# Altium project Strobe.PrjPcb
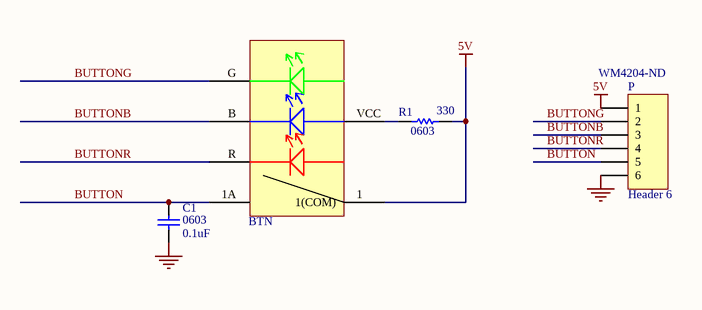
[diagram p0: Strobe.SchDoc]
1 sheet, 4 parts. Net scope: global (net labels, ports and power ports of the same name join across sheets).
Board file: Strobe.PcbDoc

## Sheet Strobe.SchDoc
size A

### Parts
BTN  KP0115ANBKG03RGB-2SJB  [KP0115ANBKG03RGB-2SJB]  (value not drawn)
C1  0603  value 0.1uF  [C0603]
P  Header 6  Supplier Part Number 1: WM4204-ND  [Molex HDR1X6]
R1  0603  value 330  [R0603]

### Nets
5V: BTN.1(1(COM)) P.1 R1.2
GND: C1.1 P.6
BUTTON: BTN.1A C1.2 P.5
BUTTONB: BTN.B(B(-)) P.3
BUTTONG: BTN.G(G(-)) P.2
BUTTONR: BTN.R(R(-)) P.4
NetBTN_VCC: BTN.VCC(3V3) R1.1

### Library data of the parts
BTN = KP0115ANBKG03RGB-2SJB: Pushbutton Switch SPST-NO Standard, Illuminated Through Hole; Manufacturer 1: NKK Switches; Actuator Material: Polyacetal; Mechanical Life: 5000000Cycles; Illumination Color: Blue,Green,Red; Throw Configuration: SPST; Max Current Rating: 100mA; Illumination Type: LED; Voltage Rating (DC): 12V; Actuator Type: Square, Button; Switch Function: Off-Mom; Supplier 1: Digi-Key; Manufacturer Part Number 1: KP0115ANBKG03RGB-2SJB; Stock 1: 22; Pricing 1: 1=20.27000, 10=18.40500, 25=17.57800, 50=16.64740, 100=16.02700, 250=14.99300, 500=12.40800 (USD); RoHS: Yes; Mount: Through Hole; Contact Material: Stainless Steel; Contact Plating: Gold; Housing Material: Glass fibre; Min Operating Temperature: -25°C; Max Operating Temperature: 50°C; Current Rating: 100mA; Package Quantity: 1; Packaging: Bulk; Max Voltage Rating (DC): 12V; Termination: PC Pins; Electrical Life: 5000000Cycles; Length: 17.4mm; Depth: 17.4mm; Lead Free: Lead Free; ComponentLink1URL: https://datasheet.ciiva.com/16864/70192969-16864678.pdf?src-supplier=Allied+Electronics; ComponentLink1Description: https://datasheet.ciiva.com/16864/70192969-16864678.pdf?src-supplier=Allied+Electronics; ComponentLink2URL: https://datasheet.ciiva.com/2870/kp01-2870071.pdf?src-supplier=Digi-Key; ComponentLink2Description: https://datasheet.ciiva.com/2870/kp01-2870071.pdf?src-supplier=Digi-Key; Supplier Part Number 1: 360-2465-ND
C1 = Cap: CAP CER 0.1UF 50V X5R 0603; Manufacturer 1: Yageo; Manufacturer Part Number 1: CC0603KRX5R9BB104; Capacitance: 100nF; Tolerance: 10%; ComponentLink1URL: https://datasheet.ciiva.com/30062/tmk212bbj106kg-t-30062083.pdf?src-supplier=Onlinecomponents.com; ComponentLink1Description: https://datasheet.ciiva.com/30062/tmk212bbj106kg-t-30062083.pdf?src-supplier=Onlinecomponents.com; ComponentLink2URL: https://datasheet.ciiva.com/139/mlcc-all-e-139570.pdf?src-supplier=Digi-Key; ComponentLink2Description: https://datasheet.ciiva.com/139/mlcc-all-e-139570.pdf?src-supplier=Digi-Key; ComponentLink3URL: https://datasheet.ciiva.com/139/mlcc-all-e-139571.pdf?src-supplier=Digi-Key; ComponentLink3Description: https://datasheet.ciiva.com/139/mlcc-all-e-139571.pdf?src-supplier=Digi-Key; ComponentLink4URL: https://datasheet.ciiva.com/139/mlcc-all-e-139572.pdf?src-supplier=Digi-Key; ComponentLink4Description: https://datasheet.ciiva.com/139/mlcc-all-e-139572.pdf?src-supplier=Digi-Key; ComponentLink5URL: https://datasheet.ciiva.com/7975/1481447-7975820.pdf?src-supplier=Element14; ComponentLink5Description: https://datasheet.ciiva.com/7975/1481447-7975820.pdf?src-supplier=Element14; ComponentLink6URL: https://datasheet.ciiva.com/144/mlccorderingcode-144037.pdf?src-supplier=Digi-Key; ComponentLink6Description: https://datasheet.ciiva.com/144/mlccorderingcode-144037.pdf?src-supplier=Digi-Key; ComponentLink7URL: https://datasheet.ciiva.com/8033/1489800-8033669.pdf?src-supplier=Element14; ComponentLink7Description: https://datasheet.ciiva.com/8033/1489800-8033669.pdf?src-supplier=Element14; ComponentLink8URL: https://datasheet.ciiva.com/15189/getdatasheetpartid-321421-15189125.pdf?src-supplier=Verical; ComponentLink8Description: https://datasheet.ciiva.com/15189/getdatasheetpartid-321421-15189125.pdf?src-supplier=Verical; ComponentLink9URL: https://datasheet.ciiva.com/144/mlccorderingcode-144038.pdf?src-supplier=Digi-Key; ComponentLink9Description: https://datasheet.ciiva.com/144/mlccorderingcode-144038.pdf?src-supplier=Digi-Key; ComponentLink10URL: https://datasheet.ciiva.com/28450/1489800-28450342.pdf?src-supplier=Element14; ComponentLink10Description: https://datasheet.ciiva.com/28450/1489800-28450342.pdf?src-supplier=Element14; ComponentLink11URL: https://datasheet.ciiva.com/144/mlccorderingcode-144039.pdf?src-supplier=Digi-Key; ComponentLink11Description: https://datasheet.ciiva.com/144/mlccorderingcode-144039.pdf?src-supplier=Digi-Key; ComponentLink12URL: https://datasheet.ciiva.com/8033/1489800-8033671.pdf?src-supplier=Element14; ComponentLink12Description: https://datasheet.ciiva.com/8033/1489800-8033671.pdf?src-supplier=Element14; ComponentLink13URL: http://www.farnell.com/datasheets/1872206.pdf?src-supplier=Farnell; ComponentLink13Description: http://www.farnell.com/datasheets/1872206.pdf?src-supplier=Farnell; ComponentLink14URL: http://uk.rs-online.com/webdocs/144c/0900766b8144c113.pdf?src-supplier=RSComponents; ComponentLink14Description: http://uk.rs-online.com/webdocs/144c/0900766b8144c113.pdf?src-supplier=RSComponents; ComponentLink15URL: http://www.farnell.com/datasheets/2048008.pdf?src-supplier=Farnell; ComponentLink15Description: http://www.farnell.com/datasheets/2048008.pdf?src-supplier=Farnell; ComponentLink16URL: http://www.mouser.com/ds/2/281/c02e-2905.pdf?src-supplier=Mouser; ComponentLink16Description: http://www.mouser.com/ds/2/281/c02e-2905.pdf?src-supplier=Mouser; ComponentLink17URL: http://components.arrow.com/part/dataview/0323_06361249?src-supplier=Arrow+Europe; ComponentLink17Description: http://components.arrow.com/part/dataview/0323_06361249?src-supplier=Arrow+Europe; ComponentLink18URL: https://search.murata.co.jp/Ceramy/image/img/A01X/G101/ENG/GRM155R71E104KE14-01.pdf?src-supplier=Digi-Key; ComponentLink18Description: https://search.murata.co.jp/Ceramy/image/img/A01X/G101/ENG/GRM155R71E104KE14-01.pdf?src-supplier=Digi-Key; ComponentLink19URL: http://www.farnell.com/datasheets/2048008.pdf?src-supplier=Newark; ComponentLink19Description: http://www.farnell.com/datasheets/2048008.pdf?src-supplier=Newark; ComponentLink20URL: http://psearch.en.murata.com/capacitor/product/GRM155R71E104KE14%23.pdf?src-supplier=Avnet; ComponentLink20Description: http://psearch.en.murata.com/capacitor/product/GRM155R71E104KE14%23.pdf?src-supplier=Avnet; ComponentLink21URL: http://www.farnell.com/datasheets/2048008.pdf?src-supplier=Element14; ComponentLink21Description: http://www.farnell.com/datasheets/2048008.pdf?src-supplier=Element14; Supplier 1: Digi-Key; Supplier Part Number 1: 311-4046-1-ND; Stock 1: 3816; Pricing 1: 1=0.10000, 10=0.05600, 50=0.03080, 100=0.02510, 500=0.01794, 1000=0.01410 (USD); RoHS: Yes; Mount: Surface Mount; Case/Package: 0603; Case Code (Imperial): 0603; Case Code (Metric): 1608; Weight: 7.1E-05oz; Min Operating Temperature: -55°C; Max Operating Temperature: 85°C; Packaging: Tape and Reel; Voltage Rating: 50V; Dielectric: X5R; Termination: SMD/SMT; Voltage Rating (DC): 50V; Package Quantity: 4000; Length: 0.063inch; Width: 0.031inch; Thickness: 0.035inch; Lead Free: Lead Free; Halogen Free: Halogen Free; ComponentLink22URL: http://www.mouser.com/ds/2/447/Yageo_UPY-GP_NP0_16V-to-50V_9-358835.pdf?src-supplier=Mouser; ComponentLink22Description: http://www.mouser.com/ds/2/447/Yageo_UPY-GP_NP0_16V-to-50V_9-358835.pdf?src-supplier=Mouser; ComponentLink23URL: http://www.yageo.com/documents/recent/UPY-GPHC_X5R_4V-to-50V_25.pdf?src-supplier=Digi-Key; ComponentLink23Description: http://www.yageo.com/documents/recent/UPY-GPHC_X5R_4V-to-50V_25.pdf?src-supplier=Digi-Key; ComponentLink24URL: http://www.yageo.com/exep/pages/download/literatures/ProductSelectionGuide%202014_Final_2.pdf?src-supplier=Digi-Key; ComponentLink24Description: http://www.yageo.com/exep/pages/download/literatures/ProductSelectionGuide%202014_Final_2.pdf?src-supplier=Digi-Key
P = Header 6: CONN HEADER VERT 6POS 2.54MM; Manufacturer 1: Molex; Number of Positions: 6; Gender: Male; Contact Resistance: 10mR; Current Rating: 4A; Voltage Rating: 250V; Max Current Rating: 7A; Max Voltage Rating (AC): 600V; Insulation Resistance: 500GR; Approvals: UL,CSA; Glow Wire Compliant: Non-compliant; LatestRevisionDate: 17-Jul-2002; LatestRevisionNote: Re-released for DXP Platform.; Publisher: Altium Limited; Supplier 1: Digi-Key; Manufacturer Part Number 1: 22-23-2061; Stock 1: 22943; Pricing 1: 1=0.43000, 10=0.40300, 100=0.28180, 500=0.24150, 1000=0.20125, 5000=0.17250, 10000=0.16100 (USD); RoHS: Yes; Mount: Through Hole,Cable; Color: White; Housing Color: Orange; Housing Material: Nylon; Contact Material: Brass,Copper Alloy; Contact Plating: Tin,Copper; Min Operating Temperature: 0°C; Max Operating Temperature: 75°C; Number of Rows: 1; Packaging: Bulk; Termination: Through Hole; Number of Contacts: 6; Orientation: Straight; Package Quantity: 1000; Number of Circuits: 6; Voltage Rating (DC): 250V; Length: 31.7mm; Height: 18.42mm; Pitch: 2.54mm; Depth: 9.02mm; Radiation Hardening: No; REACH SVHC: Unknown; Halogen Free: Low Halogen; Lead Free: Lead Free; Flammability Rating: UL94 V-0; ComponentLink1URL: https://datasheet.ciiva.com/5158/0022232061-pcb-headers-227101-5158944.pdf?src-supplier=Mouser; ComponentLink1Description: https://datasheet.ciiva.com/5158/0022232061-pcb-headers-227101-5158944.pdf?src-supplier=Mouser; ComponentLink2URL: https://datasheet.ciiva.com/10086/0022232061-pcb-headers-10086340.pdf?src-supplier=Avnet; ComponentLink2Description: https://datasheet.ciiva.com/10086/0022232061-pcb-headers-10086340.pdf?src-supplier=Avnet; ComponentLink3URL: https://datasheet.ciiva.com/11746/0900766b80d8f4d1-11746779.pdf?src-supplier=RSComponents; ComponentLink3Description: https://datasheet.ciiva.com/11746/0900766b80d8f4d1-11746779.pdf?src-supplier=RSComponents; ComponentLink4URL: https://datasheet.ciiva.com/19462/1966261-19462363.pdf?src-supplier=Jameco; ComponentLink4Description: https://datasheet.ciiva.com/19462/1966261-19462363.pdf?src-supplier=Jameco; ComponentLink5URL: https://datasheet.ciiva.com/19460/232303-19460895.pdf?src-supplier=Jameco; ComponentLink5Description: https://datasheet.ciiva.com/19460/232303-19460895.pdf?src-supplier=Jameco; ComponentLink6URL: https://datasheet.ciiva.com/26844/getdatasheetpartid-256364-26844021.pdf?src-supplier=Verical; ComponentLink6Description: https://datasheet.ciiva.com/26844/getdatasheetpartid-256364-26844021.pdf?src-supplier=Verical; ComponentLink7URL: https://datasheet.ciiva.com/16468/0022232061-pcb-headers-16468934.pdf?src-supplier=Avnet+Asia; ComponentLink7Description: https://datasheet.ciiva.com/16468/0022232061-pcb-headers-16468934.pdf?src-supplier=Avnet+Asia; ComponentLink8URL: https://datasheet.ciiva.com/16658/0022232061-pcb-headers-16658169.pdf?src-supplier=Avnet+Europe; ComponentLink8Description: https://datasheet.ciiva.com/16658/0022232061-pcb-headers-16658169.pdf?src-supplier=Avnet+Europe; ComponentLink9URL: https://datasheet.ciiva.com/30075/16920022232061-pcb-headers-30075692.pdf?src-supplier=Onlinecomponents.com; ComponentLink9Description: https://datasheet.ciiva.com/30075/16920022232061-pcb-headers-30075692.pdf?src-supplier=Onlinecomponents.com
R1 = Res1: RES SMD 330 OHM 1% 1/10W 0603; Manufacturer 1: Yageo; Manufacturer Part Number 1: RC0603FR-07330RL; Max Power Dissipation: 100mW; Temperature Coefficient: 100ppm/°C; Voltage Rating (DC): 50V; Resistance: 330R; ComponentLink1URL: https://datasheet.ciiva.com/11819/0900766b80c66297-11819490.pdf?src-supplier=RSComponents; ComponentLink1Description: https://datasheet.ciiva.com/11819/0900766b80c66297-11819490.pdf?src-supplier=RSComponents; ComponentLink2URL: https://datasheet.ciiva.com/7849/1018594-7849962.pdf?src-supplier=Element14; ComponentLink2Description: https://datasheet.ciiva.com/7849/1018594-7849962.pdf?src-supplier=Element14; ComponentLink3URL: https://datasheet.ciiva.com/17083/pyu-rc0402-51-rohs-l-6-r-17083994.pdf?src-supplier=Future+Electronics; ComponentLink3Description: https://datasheet.ciiva.com/17083/pyu-rc0402-51-rohs-l-6-r-17083994.pdf?src-supplier=Future+Electronics; ComponentLink4URL: https://datasheet.ciiva.com/7849/1018594-7849963.pdf?src-supplier=Element14; ComponentLink4Description: https://datasheet.ciiva.com/7849/1018594-7849963.pdf?src-supplier=Element14; ComponentLink5URL: https://datasheet.ciiva.com/2453/pyu-r-int-thick-7-2453661.pdf?src-supplier=Digi-Key; ComponentLink5Description: https://datasheet.ciiva.com/2453/pyu-r-int-thick-7-2453661.pdf?src-supplier=Digi-Key; ComponentLink6URL: https://datasheet.ciiva.com/2453/pyu-r-int-thick-7-2453662.pdf?src-supplier=Digi-Key; ComponentLink6Description: https://datasheet.ciiva.com/2453/pyu-r-int-thick-7-2453662.pdf?src-supplier=Digi-Key; ComponentLink7URL: https://datasheet.ciiva.com/2453/pyu-r-int-thick-7-2453663.pdf?src-supplier=Digi-Key; ComponentLink7Description: https://datasheet.ciiva.com/2453/pyu-r-int-thick-7-2453663.pdf?src-supplier=Digi-Key; ComponentLink8URL: https://datasheet.ciiva.com/12656/pyu-rc0402-51-rohs-l-6-r-12656815.pdf?src-supplier=Mouser; ComponentLink8Description: https://datasheet.ciiva.com/12656/pyu-rc0402-51-rohs-l-6-r-12656815.pdf?src-supplier=Mouser; Supplier 1: Digi-Key; Supplier Part Number 1: 311-330HRCT-ND; Stock 1: 3885547; Pricing 1: 1=0.10000, 10=0.02300, 100=0.00940, 1000=0.00421, 2500=0.00366 (USD); RoHS: Yes; Case/Package: 0603; Number of Pins: 2; Case Code (Metric): 1608; Case Code (Imperial): 0603; Min Operating Temperature: -55°C; Max Operating Temperature: 155°C; Composition: Thick Film; Features: Moisture Resistant; Number of Terminations: 2; Termination: SMD/SMT; Power Rating: 100mW; Tolerance: 1%; Voltage Rating: 50V; Packaging: Tape and Reel; Package Quantity: 1; Length: 1.6mm; Height: 0.45mm; Depth: 0.8mm; Width: 0.8mm; Lead Free: Lead Free; REACH SVHC: No SVHC; ComponentLink9URL: https://datasheet.ciiva.com/11819/0900766b80f96399-11819327.pdf?src-supplier=RSComponents; ComponentLink9Description: https://datasheet.ciiva.com/11819/0900766b80f96399-11819327.pdf?src-supplier=RSComponents; ComponentLink10URL: https://datasheet.ciiva.com/2454/pyu-r-int-thick-7-2454864.pdf?src-supplier=Digi-Key; ComponentLink10Description: https://datasheet.ciiva.com/2454/pyu-r-int-thick-7-2454864.pdf?src-supplier=Digi-Key; ComponentLink11URL: https://datasheet.ciiva.com/2454/pyu-r-int-thick-7-2454865.pdf?src-supplier=Digi-Key; ComponentLink11Description: https://datasheet.ciiva.com/2454/pyu-r-int-thick-7-2454865.pdf?src-supplier=Digi-Key; ComponentLink12URL: https://datasheet.ciiva.com/2454/pyu-r-int-thick-7-2454866.pdf?src-supplier=Digi-Key; ComponentLink12Description: https://datasheet.ciiva.com/2454/pyu-r-int-thick-7-2454866.pdf?src-supplier=Digi-Key; ComponentLink13URL: https://datasheet.ciiva.com/12555/rc0603-272842-12555334.pdf?src-supplier=Mouser; ComponentLink13Description: https://datasheet.ciiva.com/12555/rc0603-272842-12555334.pdf?src-supplier=Mouser; ComponentLink14URL: https://datasheet.ciiva.com/46440/1868787-46440904.pdf?src-supplier=Element14; ComponentLink14Description: https://datasheet.ciiva.com/46440/1868787-46440904.pdf?src-supplier=Element14; ComponentLink15URL: https://datasheet.ciiva.com/7746/443971-7746329.pdf?src-supplier=Element14; ComponentLink15Description: https://datasheet.ciiva.com/7746/443971-7746329.pdf?src-supplier=Element14; ComponentLink16URL: https://datasheet.ciiva.com/7746/443971-7746330.pdf?src-supplier=Element14; ComponentLink16Description: https://datasheet.ciiva.com/7746/443971-7746330.pdf?src-supplier=Element14; ComponentLink17URL: https://datasheet.ciiva.com/7746/1686128-7746331.pdf?src-supplier=Element14; ComponentLink17Description: https://datasheet.ciiva.com/7746/1686128-7746331.pdf?src-supplier=Element14